# Altium schematic sheet Power.SchDoc: Power schematic
size A4; SheetNumber: 2; SheetTotal: 13
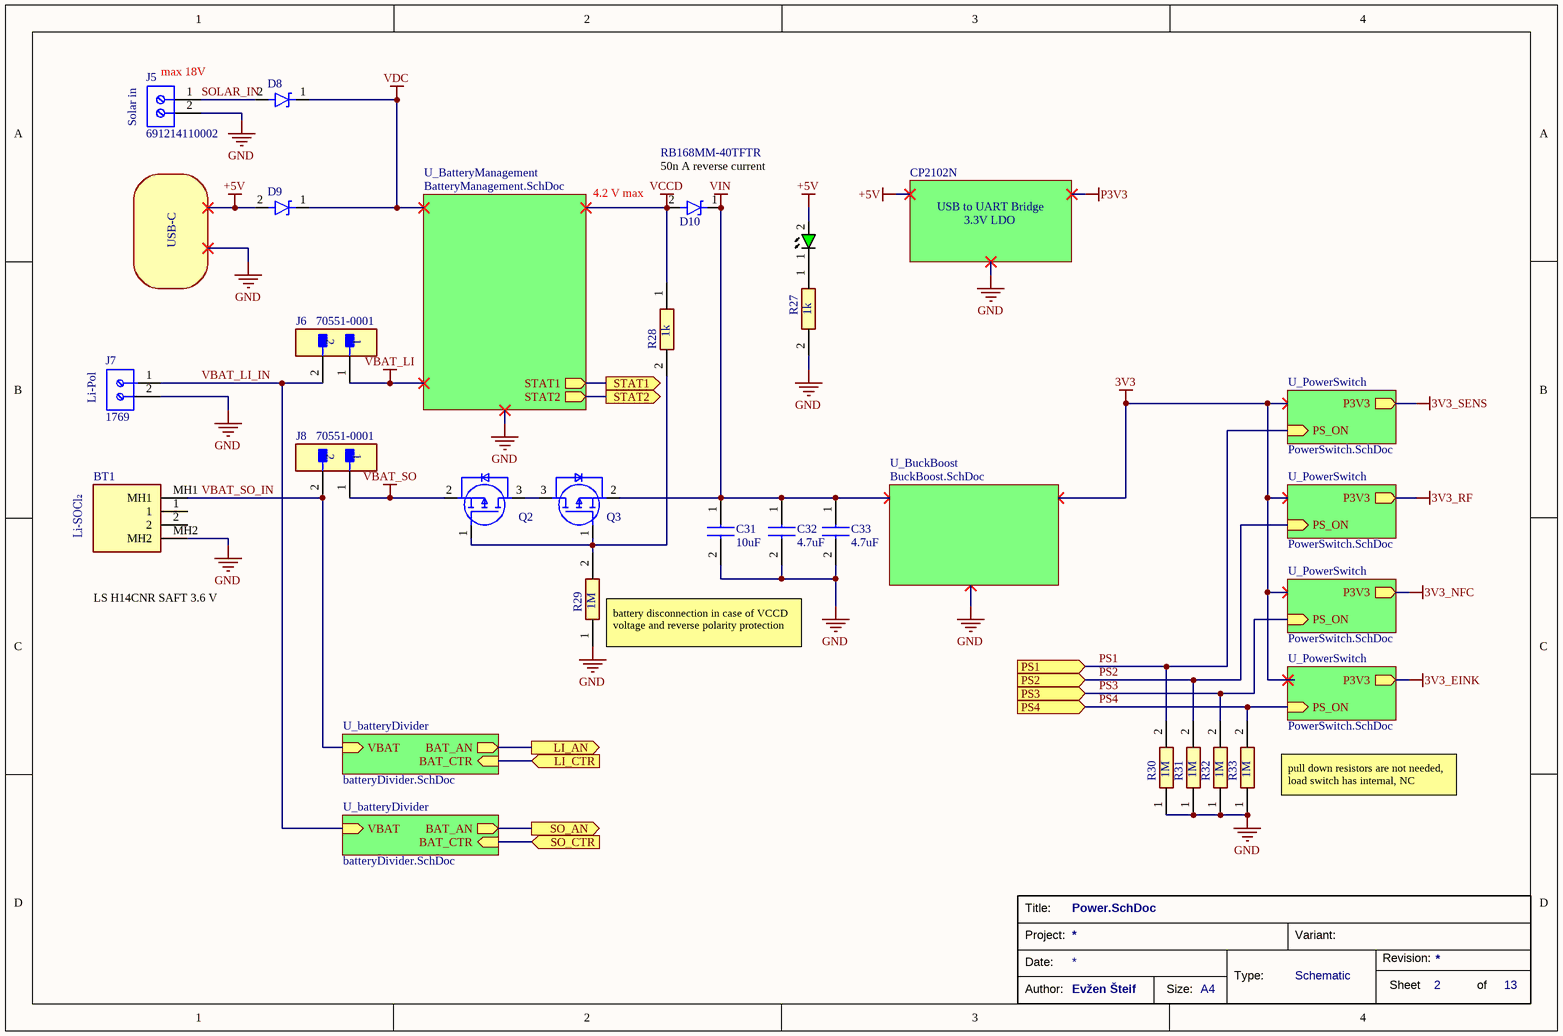
[diagram p0: Power.SchDoc]

## Parts
BT1  BX0036  [BX0036]  (value not drawn)
C31  10uF  [GRM18x]
C32  4.7uF  [CAPC1608X90N]
C33  4.7uF  [CAPC1608X90N]
D8  RB161MM-20TR  [RB161MM20TR]  (value not drawn)
D9  RB161MM-20TR  [RB161MM20TR]  (value not drawn)
D10  RB168MM-40TFTR  [RB168MM40TFTR]
J5  691214110002  [691214110002]
J6  70551-0001  [FP-70551-0036-MFG]
J7  1769  [1769]
J8  70551-0001  [FP-70551-0036-MFG]
LED6  150060GS75000  [LEDC1608X80N]  (value not drawn)
Q2  SSM3J358R,LF  [SOTFL95P240X88-3N]  (value not drawn)
Q3  SSM3J358R,LF  [SOTFL95P240X88-3N]  (value not drawn)
R27  1k  [RESC1005X35N]
R28  1k  [RESC1005X35N]
R29  1M  [RESC1005X40N]
R30  1M  [RESC1005X40N]
R31  1M  [RESC1005X40N]
R32  1M  [RESC1005X40N]
R33  1M  [RESC1005X40N]

## Sub-sheets
U_batteryDivider = batteryDivider.SchDoc: BAT_CTR (in), BAT_AN (out), VBAT (in)
U_batteryDivider = batteryDivider.SchDoc: BAT_CTR (in), BAT_AN (out), VBAT (in)
U_BatteryManagement = BatteryManagement.SchDoc: STAT1 (out), STAT2 (out)
U_BuckBoost = BuckBoost.SchDoc: no entries
U_PowerSwitch = PowerSwitch.SchDoc: PS_ON (in), P3V3 (out)
U_PowerSwitch = PowerSwitch.SchDoc: PS_ON (in), P3V3 (out)
U_PowerSwitch = PowerSwitch.SchDoc: PS_ON (in), P3V3 (out)
U_PowerSwitch = PowerSwitch.SchDoc: PS_ON (in), P3V3 (out)

## Ports
LI_AN (out, see main[2B]), LI_CTR (in, see main[2B]), PS1 (in, see main[2B], MCU[1C]), PS2 (in, see main[2B], MCU[1C]), PS3 (in, see main[2B], MCU[1C]), PS4 (in, see main[2B], MCU[1C]), SO_AN (out, see main[2B]), SO_CTR (in, see main[2B]), STAT1 (out, see main[2B], BatteryManagement[2B]), STAT2 (out, see main[2B], BatteryManagement[2B])

## Nets
3V3_EINK: sheet U_PowerSwitch/P3V3
3V3_NFC: sheet U_PowerSwitch/P3V3
3V3_RF: sheet U_PowerSwitch/P3V3
3V3_SENS: sheet U_PowerSwitch/P3V3
+5V: D9.2(A) LED6.2(A)
GND: BT1.MH2 C31.2 C32.2 C33.2 J5.2 J7.2 R27.2 R29.1 R30.1 R31.1 R32.1 R33.1
VBAT_LI: J6.1
VBAT_SO: J8.1 Q2.2(S)
VCCD: D10.2(A) R28.1
VDC: D8.1(K) D9.1(K)
VIN: C31.1 C32.1 C33.1 D10.1(K) Q3.2(S)
LI_AN: port LI_AN, sheet U_batteryDivider/BAT_AN
LI_CTR: port LI_CTR, sheet U_batteryDivider/BAT_CTR
PS1: R30.2 ; port PS1, sheet U_PowerSwitch/PS_ON
PS2: R31.2 ; port PS2, sheet U_PowerSwitch/PS_ON
PS3: R32.2 ; port PS3, sheet U_PowerSwitch/PS_ON
PS4: R33.2 ; port PS4, sheet U_PowerSwitch/PS_ON
SO_AN: port SO_AN, sheet U_batteryDivider/BAT_AN
SO_CTR: port SO_CTR, sheet U_batteryDivider/BAT_CTR
SOLAR_IN: D8.2(A) J5.1
STAT1: port STAT1, sheet U_BatteryManagement/STAT1
STAT2: port STAT2, sheet U_BatteryManagement/STAT2
VBAT_LI_IN: J6.2 J7.1 ; sheet U_batteryDivider/VBAT
VBAT_SO_IN: BT1.MH1 J8.2 ; sheet U_batteryDivider/VBAT
NetLED6_1: LED6.1(K) R27.1
NetQ2_1: Q2.1(G) Q3.1(G) R28.2 R29.2
NetQ2_3: Q2.3(D) Q3.3(D)

Not connected (* = marked no-connect by the designer): BT1 1 2

## Notes on the sheet
- (near J5) max 18V
- (near J5) Solar in
- (near D10) 50n A reverse current
- CP2102N
- USB-C
- (near D10) 4.2 V max
- USB to UART Bridge
- 3.3V LDO
- (near J7) Li-Pol
- Li-SOCl₂
- (near BT1) LS H14CNR SAFT 3.6 V
- (near R29) battery disconnection in case of VCCD voltage and reverse polarity protection
- (near R33) pull down resistors are not needed, load switch has internal, NC
- Title:
- Date:
- Project:
- Type:
- Schematic
- Variant:
- Revision:
- Sheet
- of
- Author:
- Evžen Šteif
- Size:
- A4

## Library data of the parts
BT1 = BX0036: Battery; Manufacturer_Name: Bulgin; Datasheet Link: https://www.bulgin.com/pdf/pdf.php?sku=BX0036; Height: 25.1mm; Manufacturer_Part_Number: BX0036; Mouser Part Number: 122-BX0036; Mouser Price/Stock: https://www.mouser.co.uk/ProductDetail/Bulgin/BX0036?qs=mZhjc5a7U8wkz32kfV3vfA%3D%3D; Arrow Part Number: BX0036; Arrow Price/Stock: https://www.arrow.com/en/products/bx0036/bulgin-components-plc
C31 = GRM188R61E106KA73D: Capacitor; Manufacturer_Name: Murata Electronics; Datasheet Link: https://search.murata.co.jp/Ceramy/image/img/A01X/G101/ENG/GRM188R61E106KA73-01A.pdf; Height: 0.9mm; Manufacturer_Part_Number: GRM188R61E106KA73D; Mouser Part Number: 81-GRM188R61E106KA3D; Mouser Price/Stock: https://www.mouser.co.uk/ProductDetail/Murata-Electronics/GRM188R61E106KA73D?qs=5aG0NVq1C4z8ebxPkQZf9A%3D%3D; Arrow Part Number: GRM188R61E106KA73D; Arrow Price/Stock: https://www.arrow.com/en/products/grm188r61e106ka73d/murata-manufacturing?region=nac
C32 C33 = GRM188R61E475KE11J: Capacitor; Manufacturer_Name: Murata Electronics; Datasheet Link: https://search.murata.co.jp/Ceramy/image/img/A01X/G101/ENG/GRM188R61E475KE11-01A.pdf; Height: 0.9mm; Manufacturer_Part_Number: GRM188R61E475KE11J; Mouser Part Number: 81-GRM188R61E475KE1J; Mouser Price/Stock: https://www.mouser.co.uk/ProductDetail/Murata-Electronics/GRM188R61E475KE11J?qs=hNud%2FORuBR3%2Fa9GLJFT8KA%3D%3D; Arrow Part Number: GRM188R61E475KE11J; Arrow Price/Stock: https://www.arrow.com/en/products/grm188r61e475ke11j/murata-manufacturing
D8 D9 = RB161MM-20TR: Schottky Diode; Manufacturer_Name: ROHM Semiconductor; Datasheet Link: https://fscdn.rohm.com/en/products/databook/datasheet/discrete/diode/schottky_barrier/rb161mm-20tr-e.pdf; Height: 0.9mm; Manufacturer_Part_Number: RB161MM-20TR; Mouser Part Number: 755-RB161MM-20TR; Mouser Price/Stock: https://www.mouser.co.uk/ProductDetail/ROHM-Semiconductor/RB161MM-20TR?qs=pXoXL5qUNJ0AtQ2ZS1W0NA%3D%3D
D10 = RB168MM-40TFTR: Schottky Diode; Manufacturer_Name: ROHM Semiconductor; Datasheet Link: https://www.rohm.com/products/diodes/schottky-barrier-diodes/ultra-low-ir/rb168mm-40tf-product#productDetail; Height: 0.9mm; Manufacturer_Part_Number: RB168MM-40TFTR; Mouser Part Number: 755-RB168MM-40TFTR; Mouser Price/Stock: https://www.mouser.co.uk/ProductDetail/ROHM-Semiconductor/RB168MM-40TFTR?qs=4v%252BiZTmLVHGRj2i7xya%2FtQ%3D%3D
J5 = CMP-1502-02464-2: NexarPartId: 18818288; Plating: Brass, Steel; Current: 10A; Pitch: 3.5052mm; Number of Levels: 1; Number of Contacts: 2; Wire Gauge (Min): 16AWG; Voltage: 300V; Wire Gauge (Max): 24AWG; Stripping Length: -6mm; Number of Pins: 2; Number of Rows: 1; REACH SVHC: Unknown; RoHS: Compliant; Housing Material: Nylon; Termination: Screw; Mount: Through Hole; Contact Plating: Brass, Tin; Number of Positions Per Level: 2; Color: Blue, Green; Width: 7.9mm; Voltage Rating: 300V; Length: 7.4mm; Current Rating: 10A; Wire/Cable Gauge: 24AWG; Packaging: Box; Max Operating Temperature: 105°C; Lead Pitch: 3.5mm; Height: 8.7mm; Contact Material: Brass; Min Operating Temperature: -40°C
J6 J8 = CMP-04776-000016-1: CONN HEADER R/A 2POS 2.54MM; Manufacturer: Molex; Standoff Height: 0.25mm; Number Of Contacts: 2; Voltage Rating: 250V; Conn Orientation: Right Angle; Current Rating: 3A; Conn Gender: Male; Device Class L1: Connectors; Lead Free: Yes; Pitch: 2.54mm; Automotive: No; Digikey Description: CONN HEADER R/A 2POS 2.54MM; Octopart: https://octopart.com/70551-0036-molex-773165; Category: Conn; Temperature Range Low: -40°C; Temperature: -40°C to +105°C; Mouser Description: Connector Shrouded Header 2 Position 2.54mm Solder Right Angle Thru-Hole Tube; Temperature Range High: +105°C; Device Class L3: unset; Contact Material: Gold,Nickel; Height: 7.12mm; Package: HDR2; ComponentLink2URL: https://www.molex.com/webdocs/datasheets/pdf/en-us/0705510036_PCB_HEADERS.pdf; ComponentLink2Description: Datasheet; Number Of Rows: 1; RoHS: TRUE; Device Class L2: Headers and Wire Housings; Footprint Url: https://www.molex.com/pdm_docs/sd/705510036_sd.pdf; Manufacturer Part Number: 70551-0001
J7 = 1769: Connector; Manufacturer_Name: Adafruit; Datasheet Link: https://cdn-shop.adafruit.com/datasheets/17311.pdf; Height: 5.5mm; Manufacturer_Part_Number: 1769; Mouser Part Number: 485-1769; Mouser Price/Stock: https://www.mouser.co.uk/ProductDetail/Adafruit/1769?qs=GURawfaeGuBbgoGtf2XstA%3D%3D; Arrow Part Number: 1769; Arrow Price/Stock: https://www.arrow.com/en/products/1769/adafruit-industries?utm_currency=USD&region=nac
LED6 = 150060GS75000: LED; Manufacturer_Name: Wurth Elektronik; Datasheet Link: https://componentsearchengine.com/Datasheets/2/150060GS75000.pdf; Height: 0.8mm; Manufacturer_Part_Number: 150060GS75000; Mouser Part Number: 710-150060GS75000; Mouser Price/Stock: https://www.mouser.co.uk/ProductDetail/Wurth-Elektronik/150060GS75000?qs=LlUlMxKIyB0UYkq5lDO8nA%3D%3D
Q2 Q3 = SSM3J358R,LF: MOSFET (P-Channel); Manufacturer_Name: Toshiba; Datasheet Link: https://toshiba.semicon-storage.com/ap-en/product/mosfet/detail.SSM3J358R.html; Height: 0.88mm; Manufacturer_Part_Number: SSM3J358R,LF; Mouser Part Number: 757-SSM3J358RLF; Mouser Price/Stock: https://www.mouser.co.uk/ProductDetail/Toshiba/SSM3J358RLF?qs=HXFqYaX1Q2xwvCtt1GGmkw%3D%3D; Arrow Part Number: SSM3J358R,LF; Arrow Price/Stock: https://www.arrow.com/en/products/ssm3j358rlf/toshiba?region=nac
R27 R28 = RT0402FRE071KL: Resistor; Manufacturer_Name: KEMET; Datasheet Link: https://www.yageo.com/upload/media/product/productsearch/datasheet/rchip/PYu-RT_1-to-0.01_RoHS_L_11.pdf; Height: 0.35mm; Manufacturer_Part_Number: RT0402FRE071KL; Mouser Part Number: RT0402FRE071KL; Mouser Price/Stock: https://www.mouser.co.uk/ProductDetail/YAGEO/RT0402FRE07100KL?qs=BXCcY9r%252B08CxTvf5JB1kiw%3D%3D; Arrow Part Number: RT0402FRE07100KL; Arrow Price/Stock: https://www.arrow.com/en/products/rt0402fre07100kl/yageo
R29-R33 = RC0402FR-071ML: Resistor; Manufacturer_Name: YAGEO; Datasheet Link: https://componentsearchengine.com/Datasheets/2/RC0402FR-071ML.pdf; Height: 0.4mm; Manufacturer_Part_Number: RC0402FR-071ML; Mouser Part Number: 603-RC0402FR-071ML; Mouser Price/Stock: https://www.mouser.co.uk/ProductDetail/YAGEO/RC0402FR-071ML?qs=V1yeUXFNrknfoI4987wfBQ%3D%3D; Arrow Part Number: RC0402FR-071ML; Arrow Price/Stock: https://www.arrow.com/en/products/rc0402fr-071ml/yageo?region=nac